# Altium schematic sheet Cypress.SchDoc
size A; DocumentNumber: 2; SheetNumber: 2; SheetTotal: 4
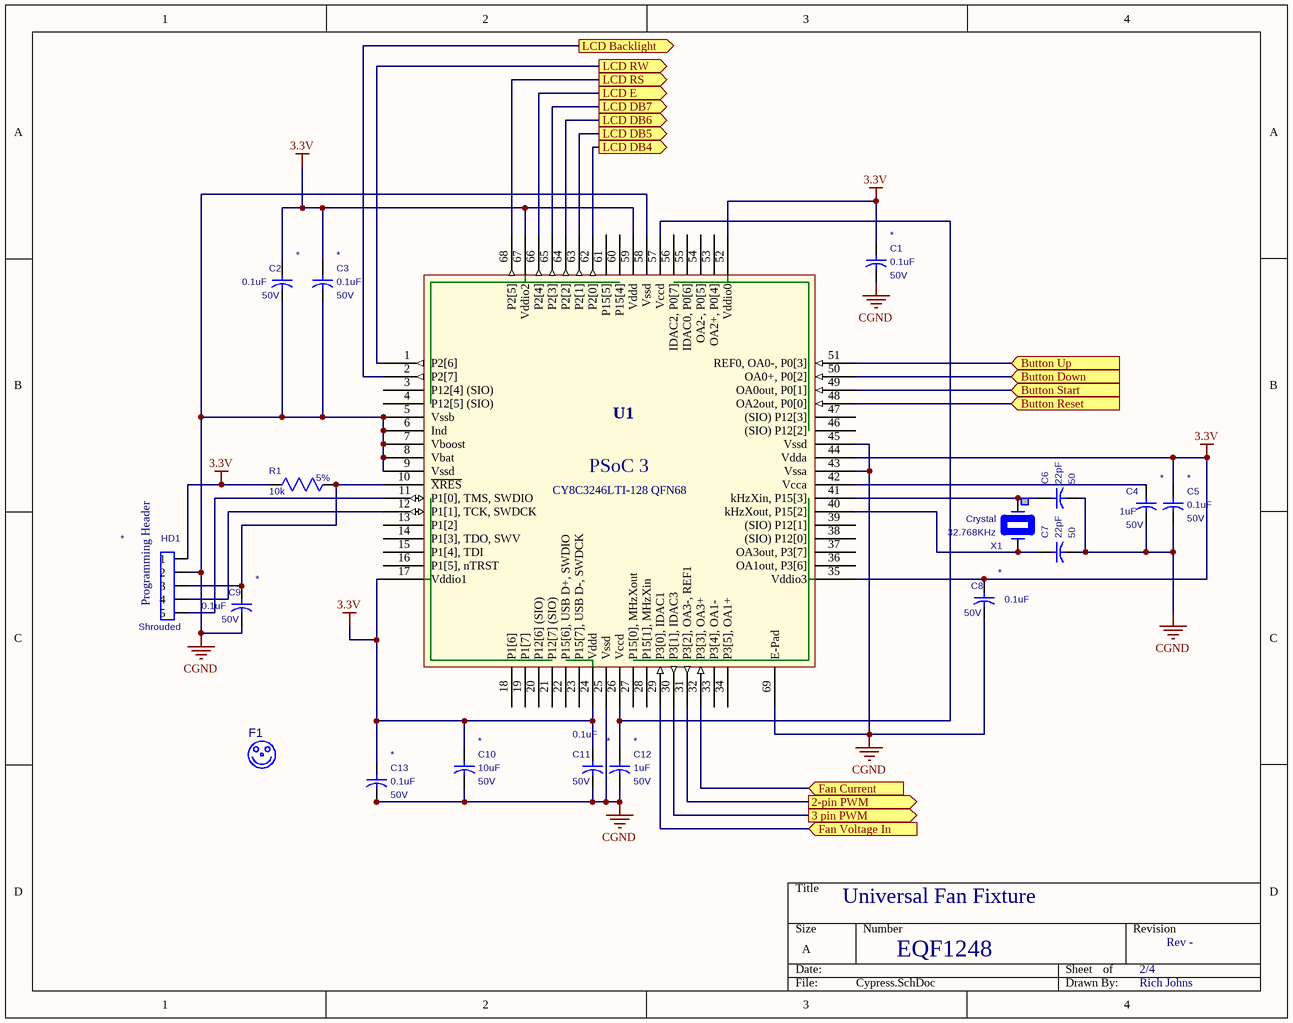
[diagram p0: Cypress.SchDoc]

## Parts
C1  value 0.1uF  Voltage: 50V  [0603]  (hidden comment: CAP_NON_POLAR_SMT)
C2  value 0.1uF  Voltage: 50V  [0603]  (hidden comment: CAP_NON_POLAR_SMT)
C3  value 0.1uF  Voltage: 50V  [0603]  (hidden comment: CAP_NON_POLAR_SMT)
C4  value 1uF  Voltage: 50V  [0603]  (hidden comment: CAP_NON_POLAR_SMT)
C5  value 0.1uF  Voltage: 50V  [0603]  (hidden comment: CAP_NON_POLAR_SMT)
C6  value 22pF  Voltage: 50  [0603]  (hidden comment: 22pF_0603)
C7  value 22pF  Voltage: 50  [0603]  (hidden comment: 22pF_0603)
C8  value 0.1uF  Voltage: 50V  [0603]  (hidden comment: CAP_NON_POLAR_SMT)
C9  value 0.1uF  Voltage: 50V  [0603]  (hidden comment: CAP_NON_POLAR_SMT)
C10  value 10uF  Voltage: 50V  [1206]  (hidden comment: CAP_NON_POLAR_SMT)
C11  value 0.1uF  Voltage: 50V  [0603]  (hidden comment: CAP_NON_POLAR_SMT)
C12  value 1uF  Voltage: 50V  [0603]  (hidden comment: CAP_NON_POLAR_SMT)
C13  value 0.1uF  Voltage: 50V  [0603]  (hidden comment: CAP_NON_POLAR_SMT)
F1  FIDUCIAL_SMILEY  [FIDUCIAL_SMILEY]  (value not drawn)
HD1  HeaderType: Shrouded  [HDR5PIN100SHRD]  (hidden comment: HDR5PIN100SHRD)
R1  value 10k  Tolerance: 5%  [RC0603REFLOW-IPC]  (hidden comment: R0603REFLOW_5%_1/8WATT)
U1  CY8C3246LTI-128 QFN68  [QFN68_8x8-MD]
X1  Frequency: 32.768KHz  XtalType: Crystal  [.03_Small_Footprint_CRYSTAL]  (hidden comment: 32.768KHZ_CRYSTAL)

## Ports
2-pin PWM (out), 3 pin PWM (out), Button Down (in), Button Reset (in), Button Start (in), Button Up (in), Fan Current (in), Fan Voltage In (in), LCD Backlight (out), LCD DB4 (out), LCD DB5 (out), LCD DB6 (out), LCD DB7 (out), LCD E (out), LCD RS (out), LCD RW (out)

## Nets
3.3V: C1.1(pin1) C2.1(pin1) C3.1(pin1) C5.1(pin1) C8.1(pin1) C10.1(pin1) C11.1(pin1) C13.1(pin1) HD1.1 R1.2(pin2) U1.17(Vddio1) U1.24(Vddd) U1.35(Vddio3) U1.44(Vdda) U1.52(Vddio0) U1.59(Vddd) U1.67(Vddio2)
CGND: C1.2(pin2) C2.2(pin2) C3.2(pin2) C4.2(pin2) C5.2(pin2) C6.2(pin2) C7.2(pin2) C8.2(pin2) C9.2(pin2) C10.2(pin2) C11.2(pin2) C12.2(pin2) C13.2(pin2) HD1.2 U1.5(Vssb) U1.6(Ind) U1.7(Vboost) U1.8(Vbat) U1.9(Vssd) U1.25(Vssd) U1.43(Vssa) U1.45(Vssd) U1.58(Vssd) U1.69(E-Pad)
2-pin PWM: U1.31(P3[2],_OA3-,_REF1) ; port 2-pin PWM
3 pin PWM: U1.30(P3[1],_IDAC3) ; port 3 pin PWM
Button Down: U1.50(OA0+,_P0[2]) ; port Button Down
Button Reset: U1.48(OA2out,_P0[0]) ; port Button Reset
Button Start: U1.49(OA0out,_P0[1]) ; port Button Start
Button Up: U1.51(REF0,_OA0-,_P0[3]) ; port Button Up
Fan Current: U1.32(P3[3],_OA3+) ; port Fan Current
Fan Voltage In: U1.29(P3[0],_IDAC1) ; port Fan Voltage In
LCD Backlight: U1.2(P2[7]) ; port LCD Backlight
LCD DB4: U1.62(P2[0]) ; port LCD DB4
LCD DB5: U1.63(P2[1]) ; port LCD DB5
LCD DB6: U1.64(P2[2]) ; port LCD DB6
LCD DB7: U1.65(P2[3]) ; port LCD DB7
LCD E: U1.66(P2[4]) ; port LCD E
LCD RS: U1.68(P2[5]) ; port LCD RS
LCD RW: U1.1(P2[6]) ; port LCD RW
NetC4_1: C4.1(pin1) U1.42(Vcca)
NetC6_1: C6.1(pin1) U1.41(kHzXin,_P15[3]) X1.1
NetC7_1: C7.1(pin1) U1.40(kHzXout,_P15[2]) X1.2
NetC9_1: C9.1(pin1) HD1.3 R1.1(pin1) U1.10(~{XRES})
NetC12_1: C12.1(pin1) U1.26(Vccd) U1.57(Vccd)
NetHD1_4: HD1.4 U1.12(P1[1],_TCK,_SWDCK)
NetHD1_5: HD1.5 U1.11(P1[0],_TMS,_SWDIO)

Not connected (* = marked no-connect by the designer): HD1 6; U1 3(P12[4]_(SIO)) 4(P12[5]_(SIO)) 13(P1[2]) 14(P1[3],_TDO,_SWV) 15(P1[4],_TDI) 16(P1[5],_nTRST) 18(P1[6]) 19(P1[7]) 20(P12[6]_(SIO)) 21(P12[7]_(SIO)) 22(P15[6],_USB_D+,_SWDIO) 23(P15[7],_USB_D-,_SWDCK) 27(P15[0],_MHzXout) 28(P15[1],_MHzXin) 33(P3[4],_OA1-) 34(P3[5],_OA1+) 36(OA1out,_P3[6]) 37(OA3out,_P3[7]) 38((SIO)_P12[0]) 39((SIO)_P12[1]) 46((SIO)_P12[2]) 47((SIO)_P12[3]) 53(OA2+,_P0[4]) 54(OA2-,_P0[5]) 55(IDAC0,_P0[6]) 56(IDAC2,_P0[7]) 60(P15[4]) 61(P15[5])

## Notes on the sheet
- (near HD1) Programming Header
- Universal Fan Fixture
- EQF1248
- 2/4
- Rev -
- Rich Johns
- (in symbol CY8C3xxxLTx-xxx QFN68) PSoC 3

## Library data of the parts
C1-C5 C8 C9 C11-C13 = 264790: Capacitor, 0.1uF, 50V, Ceramic, X7R, +/- 20%, Non-Polar, 0603, Kemet: C0603C104M5RACTU or equivalent; plIDX: 264790; Tolerance: +/- 20%; CheckedBy: Sam Rhoufiry; DNS: *; ComponentType: Capacitor; CreatedBy: Mike Tyger; LastUpdatedBy: Mike Tyger; Cost: 0.01; Composition: Ceramic; CapType: X7R; Polarity: Non-Polar; Package: 0603; Vendor: Kemet: C0603C104M5RACTU or equivalent; ComponentLink4URL: https://pdm.iconfitness.com/PDM/EBOM/PartsMaintenance/PartsMaintenance.aspx?Editplidx=264790; ComponentLink4Description: PDM Parts Maintenance
C6 C7 = 19574: Capacitor, 22pF, 50, Ceramic, NPO, +/-5%, Non-Polar, 0603, 2, Kemet:C0603C220J5GACTU or equivalent; plIDX: 19574; Composition: Ceramic; Package: 0603; CapType: NPO; Tolerance: +/-5%; Polarity: Non-Polar; Vendor: Kemet:C0603C220J5GACTU or equivalent; CheckedBy: gdeguzman; ModifyDate: 4/23/10; ComponentType: Capacitor; Supplier 1: Digi-Key; Supplier Part Number 1: 399-1053-2-ND; LastUpdatedBy: Michael Angeli; Cost: 0.01; Pins: 2; ComponentLink4URL: https://pdm.iconfitness.com/PDM/EBOM/PartsMaintenance/PartsMaintenance.aspx?Editplidx=19574; ComponentLink4Description: PDM Parts Maintenance
C10 = 265299: Capacitor, 10uF, 50V, Ceramic, X5R, +/- 20%, Non-Polar, 1206, Taiyo Yuden: UMK316BBJ106ML-T or equivalent; plIDX: 265299; Tolerance: +/- 20%; CheckedBy: Sam Rhoufiry; DNS: *; ComponentType: Capacitor; CreatedBy: Mike Tyger; LastUpdatedBy: Mike Tyger; Cost: 0.05; Composition: Ceramic; CapType: X5R; Polarity: Non-Polar; Package: 1206; Vendor: Taiyo Yuden: UMK316BBJ106ML-T or equivalent; ComponentLink1URL: http://www.yuden.co.jp/productdata/catalog/en/mlcc01_e.pdf; ComponentLink1Description: Datasheet; ComponentLink4URL: https://pdm.iconfitness.com/PDM/EBOM/PartsMaintenance/PartsMaintenance.aspx?Editplidx=265299; ComponentLink4Description: PDM Parts Maintenance
F1 = 264290: Fiducial, Smiley, PCB reference point, not a component; plIDX: 264290; Value: Smiley; ComponentType: Fiducial; CreatedBy: Mike Tyger; LastUpdatedBy: Michael Angeli; Cost: 0; Vendor: PCB reference point, not a component; ComponentLink4URL: https://pdm.iconfitness.com/PDM/EBOM/PartsMaintenance/PartsMaintenance.aspx?Editplidx=264290; ComponentLink4Description: PDM Parts Maintenance
HD1 = 1770: Header, 0.100 in., 5 pin Pins, Shrouded, AMP: 644486-5; IDF_COMP: 1; plIDX: 1770; LeadSpacing: 0.100 in.; Pins: 5 pin; Vendor: AMP: 644486-5; CheckedBy: Michael Angeli; Datasheet: g:\accel_lib\datasheets\MTA-AMP.pdf; ModifyDate: 07/30/2008 17:40:27; ComponentHeight: 625mil; ComponentType: Header; DNS: *; Cost: 0.08; ComponentLink4URL: https://pdm.iconfitness.com/PDM/EBOM/PartsMaintenance/PartsMaintenance.aspx?Editplidx=1770; ComponentLink4Description: PDM Parts Maintenance
R1 = 15593: Resistor, 18, ThickFilm, 5%, 0603, 1/8W, Any; plIDX: 15593; DNS: *; Wattage: 1/8W; Composition: ThickFilm; Package: 0603; Vendor: Any; CheckedBy: *; ModifyDate: 05/30/2007 09:48:36; ComponentType: Resistor; Cost: 0.001; ComponentLink4URL: https://pdm.iconfitness.com/PDM/EBOM/PartsMaintenance/PartsMaintenance.aspx?Editplidx=15593; ComponentLink4Description: PDM Parts Maintenance
U1 = CY8C3xxxLTx-xxx QFN68: CY8C3xxxLTx-xxx 68 pin QFN; MFN: Cypress Semiconductor; MFG: Cypress; MFGPN: CY8C3xxxLTx-xxx; Vendor: Cypress; VPN: CY8C3246LTI-128
X1 = 19127: Xtal, 0.7 mm, Cylinder, 2, Crystal, 32.768KHz, ECS: ECS-.327-12.5-13;Alternates require approval; LeadSpacing: 0.7 mm; plIDX: 19127; CheckedBy: Sam Rhoufiry; Package: Cylinder; Pins: 2; Vendor: ECS: ECS-.327-12.5-13;Alternates require approval; Datasheet: G:\accel_lib\datasheets\Crystal_32768KHz_ECS-3x8.pdf; ModifyDate: 4/16/10; ComponentType: Xtal; DNS: *; Cost: 0.0945; ComponentLink4URL: https://pdm.iconfitness.com/PDM/EBOM/PartsMaintenance/PartsMaintenance.aspx?Editplidx=19127; ComponentLink4Description: PDM Parts Maintenance